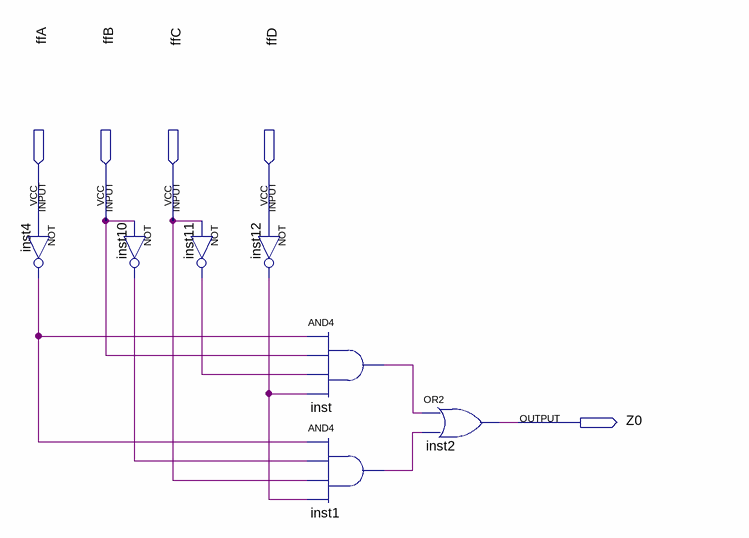
[diagram p0: schematic sheet]
// Quartus schematic SaidaZ0.bdf as structural Verilog: 7 symbols, 5 pins
module SaidaZ0 (
  input  ffA,
  input  ffB,
  input  ffC,
  input  ffD,
  output Z0
);

  wire inst1_out, inst4_out, inst10_out, inst11_out, inst12_out, inst_out;

  not inst4 (inst4_out, ffA);
  not inst10 (inst10_out, ffB);
  not inst11 (inst11_out, ffC);
  not inst12 (inst12_out, ffD);
  and inst (inst_out, inst4_out, ffB, inst11_out, inst12_out);
  and inst1 (inst1_out, inst4_out, inst10_out, ffC, inst12_out);
  or inst2 (Z0, inst_out, inst1_out);
endmodule
